# Altium project soldering_station.PrjPcb
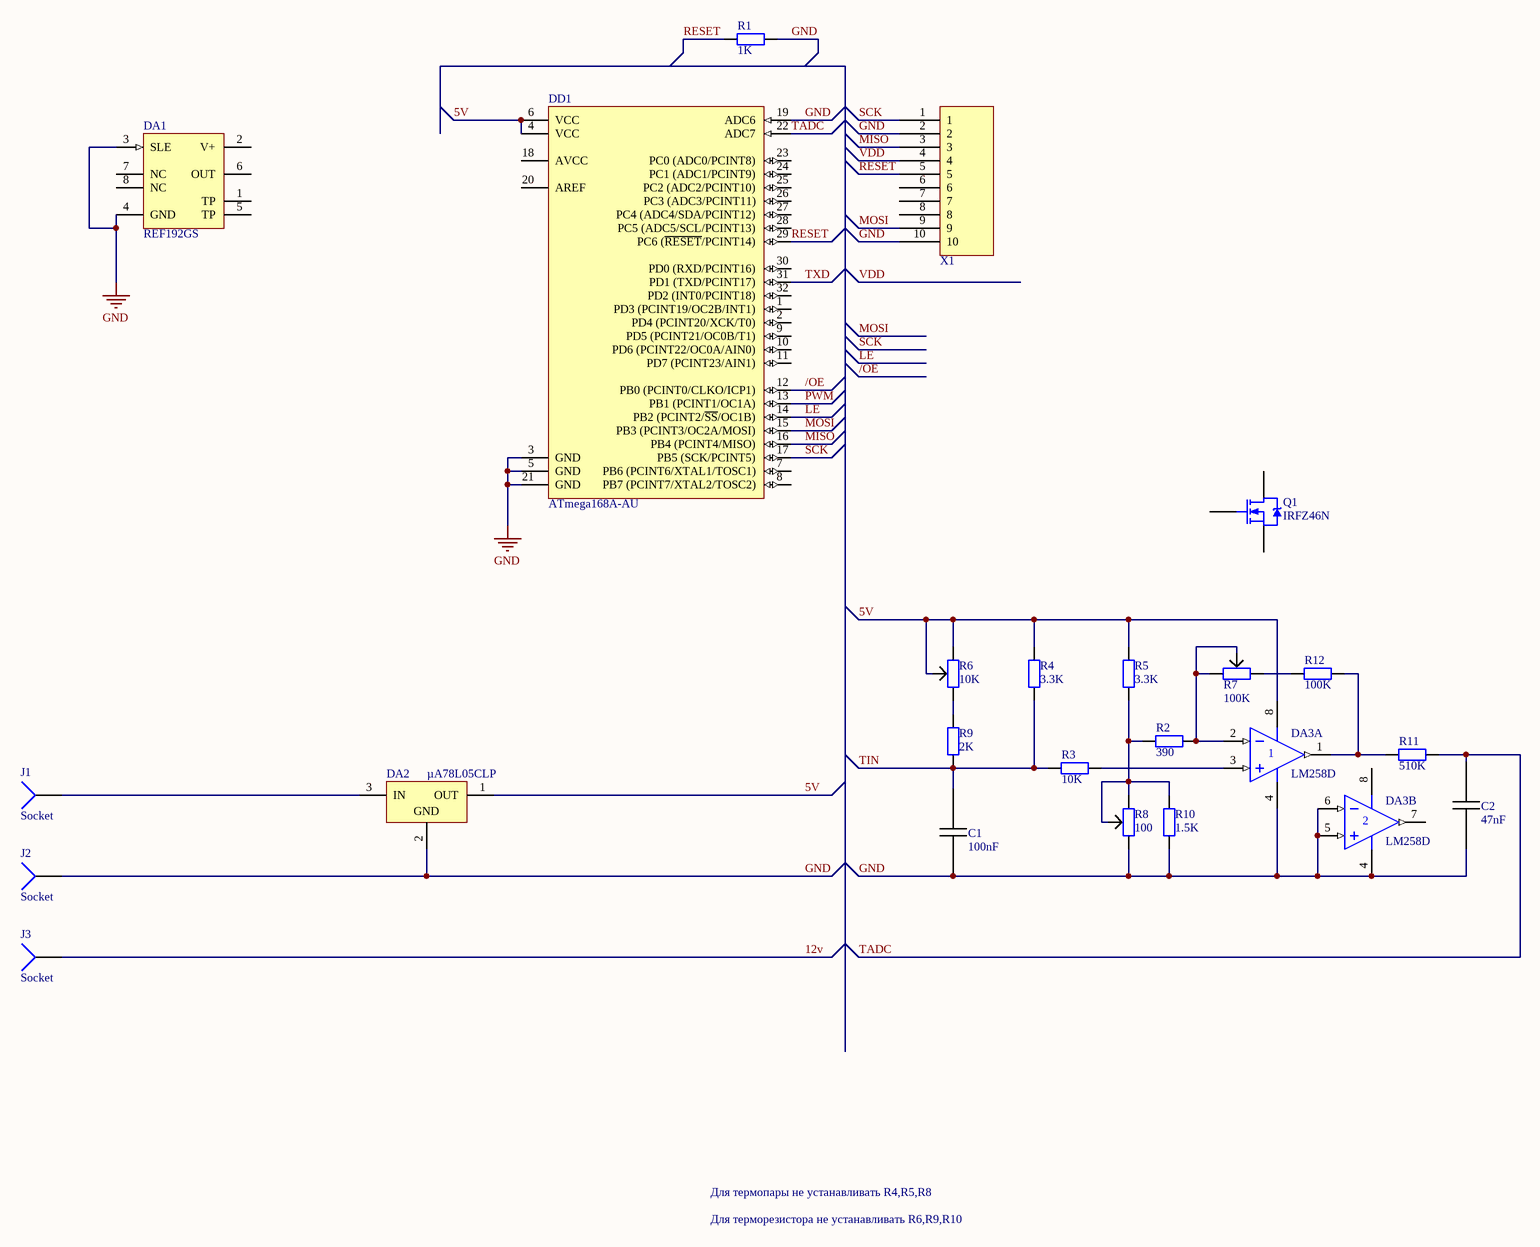
[diagram p0: cpu.SchDoc]
1 sheet, 23 parts. Net scope: global (net labels, ports and power ports of the same name join across sheets).
Board file: PCB.PcbDoc

## Sheet cpu.SchDoc
size A3; PageSetup: Record=PageOptions|CenterHorizontal=True|CenterVertical=True|PrintScale=1.00|XCorrection=1.00|YCorrection=1.00|PrintKind=1|BorderSize=5000000|LeftOffset=0|BottomOffset=0|Orientation=2|PaperLength=1000|PaperWidth=1000|Scale=100|PaperSource=7|PrintQuality=-4|MediaType=1|DitherType=10|PaperKind=A5|PrintScaleMode=1

### Parts
C1  100nF  [R1206]
C2  47nF  [R1206]
DA1  REF192GS  [SO-8_N]
DA2  µA78L05CLP  [LP03]
DA3  LM258D  [D008_L]  (parts A,B of 2)
DD1  ATmega168A-AU  [32A_N]
J1  Socket  [PIN1]
J2  Socket  [PIN1]
J3  Socket  [PIN1]
Q1  IRFZ46N  [TO-220AB]
R1  1K  [R1206]
R2  390  [R1206]
R3  10K  [R1206]
R4  3.3K  [R1206]
R5  3.3K  [R1206]
R6  10K  [3296x]
R7  100K  [3296x]
R8  100  [3296x]
R9  2K  [R1206]
R10  1.5K  [R1206]
R11  510K  [R1206]
R12  100K  [R1206]
X1  BHS-10  [BHS-10]  (value not drawn)

### Nets
GND: C1.1 C2.1 DA1.3(SLE) DA1.4(GND) DA2.2(GND) DA3.4(V-) DA3.5(IN+) DA3.6(IN-) DD1.3(GND) DD1.5(GND) DD1.19(ADC6) DD1.21(GND) J2.1 R1.2 R8.1 R10.1 X1.2 X1.10
5V: DA2.1(OUT) DA3.8(V+) DD1.4(VCC) DD1.6(VCC) R4.2 R5.2 R6.2 R6.3
12v: J3.1
/OE: DD1.12(PB0_(PCINT0/CLKO/ICP1))
LE: DD1.14(PB2_(PCINT2/~{SS}/OC1B))
MISO: DD1.16(PB4_(PCINT4/MISO)) X1.3
MOSI: DD1.15(PB3_(PCINT3/OC2A/MOSI)) X1.9
PWM: DD1.13(PB1_(PCINT1/OC1A))
RESET: DD1.29(PC6_(~{RESET}/PCINT14)) R1.1 X1.5
SCK: DD1.17(PB5_(SCK/PCINT5)) X1.1
TADC: C2.2 DD1.22(ADC7) R11.1
TIN: C1.2 R3.1 R4.1 R9.1
TXD: DD1.31(PD1_(TXD/PCINT17))
VDD: X1.4
NetDA2_3: DA2.3(IN) J1.1
NetDA3_1: DA3.1(OUT) R11.2 R12.1
NetDA3_2: DA3.2(IN-) R2.2 R7.1 R7.2
NetDA3_3: DA3.3(IN+) R3.2
NetR2_1: R2.1 R5.1 R8.2 R8.3 R10.2
NetR6_1: R6.1 R9.2
NetR7_3: R7.3 R12.2

Not connected (* = marked no-connect by the designer): DA1 1(TP) 2(V+) 5(TP) 6(OUT) 7(NC) 8(NC); DA3 7(OUT); DD1 1(PD3_(PCINT19/OC2B/INT1)) 2(PD4_(PCINT20/XCK/T0)) 7(PB6_(PCINT6/XTAL1/TOSC1)) 8(PB7_(PCINT7/XTAL2/TOSC2)) 9(PD5_(PCINT21/OC0B/T1)) 10(PD6_(PCINT22/OC0A/AIN0)) 11(PD7_(PCINT23/AIN1)) 18(AVCC) 20(AREF) 23(PC0_(ADC0/PCINT8)) 24(PC1_(ADC1/PCINT9)) 25(PC2_(ADC2/PCINT10)) 26(PC3_(ADC3/PCINT11)) 27(PC4_(ADC4/SDA/PCINT12)) 28(PC5_(ADC5/SCL/PCINT13)) 30(PD0_(RXD/PCINT16)) 32(PD2_(INT0/PCINT18)); Q1 1(G) 2(D) 3(S); X1 6 7 8

### Notes on the sheet
- Для термопары не устанавливать R4,R5,R8
- Для терморезистора не устанавливать R6,R9,R10

### Library data of the parts
C1 C2 = cap
DA1 = REF192GS: 2.50V, Precision Micropower, Low-Dropout, Voltage Reference; Note: Pins 7 and 8 are not connected; Pins 1 and 5 are factory test points, make no electrical connection; Published: 8-Jun-2000; LatestRevisionDate: 13-Apr-2006; LatestRevisionNote: IPC-7351 Footprint Added.; DatasheetVersion: REV. C; PackageVersion: revA; PackageReference: SO-8; Publisher: Altium Limited; PackageDescription: 8-Pin Small Outline Integrated Circuit 1.27 mm Pitch; Code_JEDEC: MS-012-AA; Code_IPC: SOIC127P600-8; ComponentLink1Description: Manufacturer Link; ComponentLink1URL: http://www.analog.com/en/prod/0,,769_838_REF191%2C00.html; ComponentLink2Description: Datasheet; ComponentLink2URL: http://www.analog.com/UploadedFiles/Data_Sheets/564838270REF19x_h.pdf
DA2 = µA78L05CLP: Positive-Voltage Regulator; Published: 15-Apr-2002; LatestRevisionDate: 06-Jun-2005; LatestRevisionNote: Sch pins 1 & 3 swapped; DatasheetVersion: Jul-2000; PackageVersion: Nov-2001; PackageReference: LP03; Publisher: Altium Limited; PackageDescription: TO, Flat Index; 3 In-Line, Axial Leads; Body Dia. 4.8mm; Leads 0.56 x 0.41 mm (max); Code_JEDEC: TO-226-AA; ComponentLink1Description: Manufacturer Link; ComponentLink1URL: http://www.ti.com/; ComponentLink2Description: Datasheet; ComponentLink2URL: http://www-s.ti.com/sc/ds/ua78l05a.pdf
DA3 = LM258D: Dual Operational Amplifier; Published: 15-Apr-2002; LatestRevisionDate: 13-Apr-2006; LatestRevisionNote: IPC-7351 Footprint Added.; DatasheetVersion: Aug-1988; PackageVersion: Jan-1998; PackageReference: D008; Publisher: Altium Limited; PackageDescription: 8-Pin Small Outline Integrated Circuit 1.27 mm Pitch; Code_IPC: SOIC127P600-8; ComponentLink1Description: Manufacturer Link; ComponentLink1URL: http://www.ti.com/; ComponentLink2Description: Datasheet; ComponentLink2URL: http://www-s.ti.com/sc/ds/lm258.pdf
DD1 = ATmega168A-AU: 8-bit AVR Microcontroller, 16KB Flash, 512 Bytes EEPROM, 1KB SRAM, 32-pin TQFP, Industrial Grade (-40°C to 85°C); Published: 1-Apr-2010; DatasheetVersion: revA, Jan-2010; PackageVersion: revB, Oct-2001; PackageReference: 32A; Publisher: Altium Limited; PackageDescription: 32-Lead, 7x7x1.0 mm Body, 0.8mm Lead Pitch, Thin Profile Plastic Quad Flat Package (TQFP); Supplier 1: Digi-Key; Supplier Part Number 1: ATMEGA168A-AU-ND; Supplier 2: Mouser; Supplier Part Number 2: 556-ATMEGA168A-AU; Code_JEDEC: MS-026-ABA; ComponentLink1Description: Manufacturer Link; ComponentLink1URL: http://www.atmel.com/products/avr/default.asp?; ComponentLink2Description: ATmega48A/48PA/88A/88PA/168A/168PA/328/328P Datasheet; ComponentLink2URL: http://www.atmel.com/dyn/resources/prod_documents/8271.pdf; ComponentLink3Description: ATmega48A/48PA/88A/88PA/168A/168PA/328/328P Summary; ComponentLink3URL: http://www.atmel.com/dyn/resources/prod_documents/8271S.pdf; ComponentLink4Description: Atmel.com Home; ComponentLink4URL: http://www.atmel.com
Q1 = IRFZ46N: HEXFET Power MOSFET; Note: Pin 2 is electrically connected to pin 4.; Published: 8-Jun-2000; LatestRevisionDate: 17-Jul-2002; LatestRevisionNote: Re-released for DXP Platform.; DatasheetVersion: Aug-1997; PackageVersion: Feb-1997; PackageReference: TO-220AB; Publisher: Altium Limited; PackageDescription: TO, Thru-Hole, Vertical, Heatsink Mounted; 3 In-Line Leads; Pitch 2.54 mm; ComponentLink1Description: Manufacturer Link; ComponentLink1URL: http://www.irf.com/; ComponentLink2Description: Datasheet; ComponentLink2URL: http://www.irf.com/product-info/datasheets/data/irfz46n.pdf
R1-R5 R9-R12 = Res
R6-R8 = RES_P
J1-J3 = Socket: LatestRevisionDate: 17-Jul-2002; LatestRevisionNote: Re-released for DXP Platform.; Publisher: Altium Limited